# EAGLE design Scheda ufficiale 2020 team SPQR 3 (EAGLE 9.5.2)
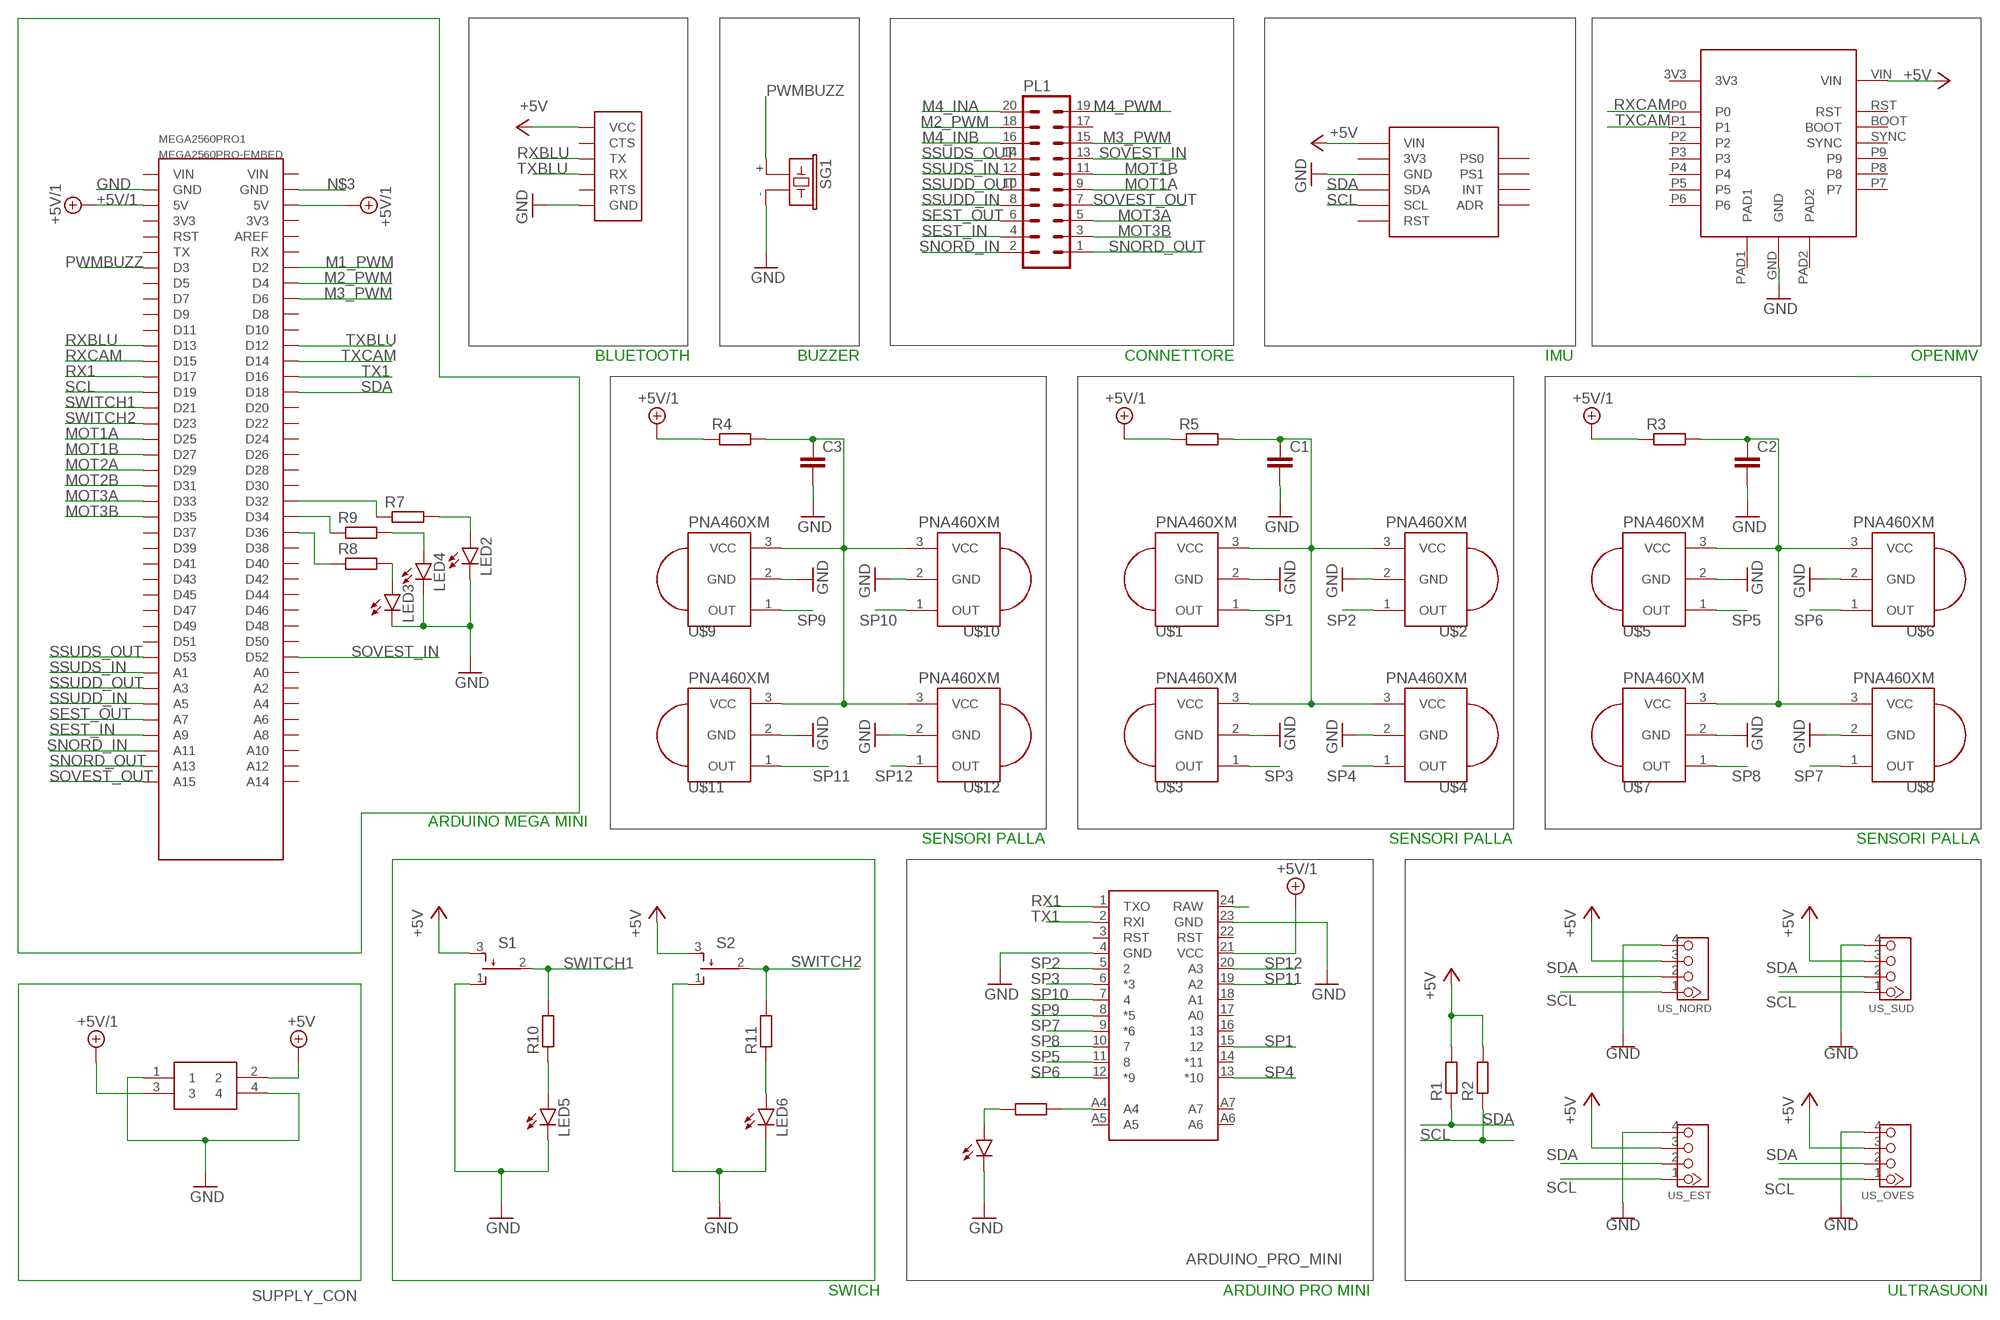
[diagram p0: schematic, sheet 1]

## Parts
ARDUINO_PRO_MINI  ARDUINO_PRO_MINI  [ARDUINO_PRO_MINI]
C1  C-EUC0805  [C0805]
C2  C-EUC0805  [C0805]
C3  C-EUC0805  [C0805]
LED1  LEDCHIPLED_1206  [CHIPLED_1206]
LED2  LEDCHIPLED_1206  [CHIPLED_1206]
LED3  LEDCHIPLED_1206  [CHIPLED_1206]
LED4  LEDCHIPLED_1206  [CHIPLED_1206]
LED5  LEDCHIPLED_1206  [CHIPLED_1206]
LED6  LEDCHIPLED_1206  [CHIPLED_1206]
MEGA2560PRO1  MEGA2560PRO-EMBED  [MEGA2560PRO-EMBED]
PL1  20V  [20V]
R1  R-EU_R0805  [R0805]
R2  R-EU_R0805  [R0805]
R3  R-EU_R0805  [R0805]
R4  R-EU_R0805  [R0805]
R5  R-EU_R0805  [R0805]
R6  R-EU_R0805  [R0805]
R7  R-EU_R0805  [R0805]
R8  R-EU_R0805  [R0805]
R9  R-EU_R0805  [R0805]
R10  R-EU_R0805  [R0805]
R11  R-EU_R0805  [R0805]
S1  TL38PO  [TL3XPO]
S2  TL38PO  [TL3XPO]
SG1  F/CM12P  [F/CM12P]
SUPPLY_CON  39-28-1043  [39-28-1043]
U$1  PNA460XM  [PNA460XM]
U$2  PNA460XM  [PNA460XM]
U$3  PNA460XM  [PNA460XM]
U$4  PNA460XM  [PNA460XM]
U$5  PNA460XM  [PNA460XM]
U$6  PNA460XM  [PNA460XM]
U$7  PNA460XM  [PNA460XM]
U$8  PNA460XM  [PNA460XM]
U$9  PNA460XM  [PNA460XM]
U$10  PNA460XM  [PNA460XM]
U$11  PNA460XM  [PNA460XM]
U$12  PNA460XM  [PNA460XM]
U$14  BLUESMIRF  [BLUESMIRF]
U$16  BNO055  [BNO055]
U$17  OPENMV_H7  [OPENMV_H7]
US_EST  TWIG_2.0  [2.0_1X4]
US_NORD  TWIG_2.0  [2.0_1X4]
US_OVES  TWIG_2.0  [2.0_1X4]
US_SUD  TWIG_2.0  [2.0_1X4]

## Nets
+5V: R1.2 R2.2 S1.3(S) S2.3(S) SUPPLY_CON.2 U$14.VCC U$16.VIN U$17.VIN US_EST.3 US_NORD.3 US_OVES.3 US_SUD.3
+5V/1: ARDUINO_PRO_MINI.21(VCC) MEGA2560PRO1.5V@1(5V) MEGA2560PRO1.5V@2(5V) R3.1 R4.1 R5.1 SUPPLY_CON.3
GND: ARDUINO_PRO_MINI.4(GND) ARDUINO_PRO_MINI.23(GND) C1.2 C2.2 C3.2 LED1.C LED2.C LED3.C LED4.C LED5.C LED6.C MEGA2560PRO1.GND@1(GND) S1.1(O) S2.1(O) SG1.- SUPPLY_CON.1 SUPPLY_CON.4 U$1.2(GND) U$2.2(GND) U$3.2(GND) U$4.2(GND) U$5.2(GND) U$6.2(GND) U$7.2(GND) U$8.2(GND) U$9.2(GND) U$10.2(GND) U$11.2(GND) U$12.2(GND) U$14.GND U$16.GND U$17.GND US_EST.4 US_NORD.4 US_OVES.4 US_SUD.4
M1_PWM: MEGA2560PRO1.D2
M2_PWM: MEGA2560PRO1.D4 PL1.18
M3_PWM: MEGA2560PRO1.D6 PL1.15
M4_INA: PL1.20
M4_INB: PL1.16
M4_PWM: PL1.19
MOT1A: MEGA2560PRO1.D25 PL1.9
MOT1B: MEGA2560PRO1.D27 PL1.11
MOT2A: MEGA2560PRO1.D29
MOT2B: MEGA2560PRO1.D31
MOT3A: MEGA2560PRO1.D33 PL1.5
MOT3B: MEGA2560PRO1.D35 PL1.3
N$1: MEGA2560PRO1.D36 R8.1
N$2: ARDUINO_PRO_MINI.24(RAW)
N$3: MEGA2560PRO1.GND@2(GND)
N$4: LED3.A R8.2
N$7: MEGA2560PRO1.D34 R9.1
N$10: ARDUINO_PRO_MINI.A4 R6.2
N$11: LED1.A R6.1
N$13: MEGA2560PRO1.D32 R7.1
N$33: LED5.A R10.1
N$35: LED4.A R9.2
N$36: LED6.A R11.1
N$39: LED2.A R7.2
POWERBLOCK1: C2.1 R3.2 U$5.3(VCC) U$6.3(VCC) U$7.3(VCC) U$8.3(VCC)
POWERBLOCK2: C1.1 R5.2 U$1.3(VCC) U$2.3(VCC) U$3.3(VCC) U$4.3(VCC)
POWERBLOCK3: C3.1 R4.2 U$9.3(VCC) U$10.3(VCC) U$11.3(VCC) U$12.3(VCC)
PWMBUZZ: MEGA2560PRO1.D3 SG1.+
RX1: ARDUINO_PRO_MINI.1(TXO) MEGA2560PRO1.D17
RXBLU: MEGA2560PRO1.D13 U$14.TX
RXCAM: MEGA2560PRO1.D15 U$17.P0
SCL: MEGA2560PRO1.D19 R2.1 U$16.SCL US_EST.1 US_NORD.1 US_OVES.1 US_SUD.1
SDA: MEGA2560PRO1.D18 R1.1 U$16.SDA US_EST.2 US_NORD.2 US_OVES.2 US_SUD.2
SEST_IN: MEGA2560PRO1.A9 PL1.4
SEST_OUT: MEGA2560PRO1.A7 PL1.6
SNORD_IN: MEGA2560PRO1.A11 PL1.2
SNORD_OUT: MEGA2560PRO1.A13 PL1.1
SOVEST_IN: MEGA2560PRO1.D52 PL1.13
SOVEST_OUT: MEGA2560PRO1.A15 PL1.7
SP1: ARDUINO_PRO_MINI.15 U$1.1(OUT)
SP2: ARDUINO_PRO_MINI.5 U$2.1(OUT)
SP3: ARDUINO_PRO_MINI.6(*3) U$3.1(OUT)
SP4: ARDUINO_PRO_MINI.13(*10) U$4.1(OUT)
SP5: ARDUINO_PRO_MINI.11 U$5.1(OUT)
SP6: ARDUINO_PRO_MINI.12(*9) U$6.1(OUT)
SP7: ARDUINO_PRO_MINI.9(*6) U$8.1(OUT)
SP8: ARDUINO_PRO_MINI.10 U$7.1(OUT)
SP9: ARDUINO_PRO_MINI.8(*5) U$9.1(OUT)
SP10: ARDUINO_PRO_MINI.7 U$10.1(OUT)
SP11: ARDUINO_PRO_MINI.19(A2) U$11.1(OUT)
SP12: ARDUINO_PRO_MINI.20(A3) U$12.1(OUT)
SSUDD_IN: MEGA2560PRO1.A5 PL1.8
SSUDD_OUT: MEGA2560PRO1.A3 PL1.10
SSUDS_IN: MEGA2560PRO1.A1 PL1.12
SSUDS_OUT: MEGA2560PRO1.D53 PL1.14
SWITCH1: MEGA2560PRO1.D21 R10.2 S1.2(P)
SWITCH2: MEGA2560PRO1.D23 R11.2 S2.2(P)
TX1: ARDUINO_PRO_MINI.2(RXI) MEGA2560PRO1.D16
TXBLU: MEGA2560PRO1.D12 U$14.RX
TXCAM: MEGA2560PRO1.D14 U$17.P1
Unconnected: ARDUINO_PRO_MINI.3(RST) ARDUINO_PRO_MINI.14(*11) ARDUINO_PRO_MINI.16 ARDUINO_PRO_MINI.17(A0) ARDUINO_PRO_MINI.18(A1) ARDUINO_PRO_MINI.22(RST) ARDUINO_PRO_MINI.A5 ARDUINO_PRO_MINI.A6 ARDUINO_PRO_MINI.A7 MEGA2560PRO1.3V3@1(3V3) MEGA2560PRO1.3V3@2(3V3) MEGA2560PRO1.A0 MEGA2560PRO1.A2 MEGA2560PRO1.A4 MEGA2560PRO1.A6 MEGA2560PRO1.A8 MEGA2560PRO1.A10 MEGA2560PRO1.A12 MEGA2560PRO1.A14 MEGA2560PRO1.AREF MEGA2560PRO1.D5 MEGA2560PRO1.D7 MEGA2560PRO1.D8 MEGA2560PRO1.D9 MEGA2560PRO1.D10 MEGA2560PRO1.D11 MEGA2560PRO1.D20 MEGA2560PRO1.D22 MEGA2560PRO1.D24 MEGA2560PRO1.D26 MEGA2560PRO1.D28 MEGA2560PRO1.D30 MEGA2560PRO1.D37 MEGA2560PRO1.D38 MEGA2560PRO1.D39 MEGA2560PRO1.D40 MEGA2560PRO1.D41 MEGA2560PRO1.D42 MEGA2560PRO1.D43 MEGA2560PRO1.D44 MEGA2560PRO1.D45 MEGA2560PRO1.D46 MEGA2560PRO1.D47 MEGA2560PRO1.D48 MEGA2560PRO1.D49 MEGA2560PRO1.D50 MEGA2560PRO1.D51 MEGA2560PRO1.RST MEGA2560PRO1.RX MEGA2560PRO1.TX MEGA2560PRO1.VIN@1(VIN) MEGA2560PRO1.VIN@2(VIN) PL1.17 U$14.CTS U$14.RTS U$16.3V3 U$16.ADR U$16.INT U$16.PS0 U$16.PS1 U$16.RST U$17.3V3 U$17.BOOT U$17.P2 U$17.P3 U$17.P4 U$17.P5 U$17.P6 U$17.P7 U$17.P8 U$17.P9 U$17.PAD1 U$17.PAD2 U$17.RST U$17.SYNC

## Notes on the sheet
- BLUETOOTH | BUZZER | CONNETTORE | IMU | OPENMV
- ARDUINO MEGA MINI
- SENSORI PALLA | SENSORI PALLA | SENSORI PALLA
- ARDUINO PRO MINI
- SWICH | ULTRASUONI

## Library data of the parts
ARDUINO_PRO_MINI = SparkFun-Boards:ARDUINO_PRO_MINI: SparkFun Pro Mini Pro Mini compatible footprint. Dimensions: 0.7 x 1.3" PCB Thickness: 0.8mm SparkFun Products: 3.3V/8MHz <https://www.sparkfun.com/products/11114> 5V/16MHz <https://www.sparkfun.com/products/11113>
C1-C3 = rcl:C-EU: CAPACITOR, European symbol; SPICEPREFIX: C
LED1-LED6 = led:LED: LED OSRAM: - CHIPLED LG R971, LG N971, LY N971, LG Q971, LY Q971, LO R971, LY R971 LH N974, LH R974 LS Q976, LO Q976, LY Q976 LO Q996 - Hyper CHIPLED LW Q18S LB Q993, LB Q99A, LB R99A - SideLED LS A670, LO A670, LY A670, LG A670, LP A670 LB A673, LV A673, LT A673, LW A673 LH A674 LY A675 LS A676, LA A676, LO A676, LY A676, LW A676 LS A679, LY A679, LG A679 - Hyper Micro SIDELED® LS Y876, LA Y876, LO Y876, LY Y876 LT Y87S - SmartLED LW L88C, LW L88S LB L89C, LB L89S, LG L890 LS L89K, LO L89K, LY L89K LS L896, LA L896, LO L896, LY L896 - TOPLED LS T670, LO T670, LY T670, LG T670, LP T670 LSG T670, LSP T670, LSY T670, LOP T670, LYG T670 LG T671, LOG T671, LSG T671 LB T673, LV T673, LT T673, LW T673 LH T674 LS T676, LA T676, LO T676, LY T676, LB T676, LH T676, LSB T676, LW T676 LB T67C, LV T67C, LT T67C, LS T67K, LO T67K, LY T67K, LW E67C LS E67B, LA E67B, LO E67B, LY E67B, LB E67C, LV E67C, LT E67C LW T67C LS T679, LY T679, LG T679 LS T770, LO T770, LY T770, LG T770, LP T770 LB T773, LV T773, LT T773, LW T773 LH T774 LS E675, LA E675, LY E675, LS T675 LS T776, LA T776, LO T776, LY T776, LB T776 LHGB T686 LT T68C, LB T68C - Hyper Mini TOPLED® LB M676 - Mini TOPLED Santana® LG M470 LS M47K, LO M47K, LY M47K Source: http://www.osram.convergy.de LUXEON: - LUMILED® LXK2-PW12-R00, LXK2-PW12-S00, LXK2-PW14-U00, LXK2-PW14-V00 LXK2-PM12-R00, LXK2-PM12-S00, LXK2-PM14-U00 LXK2-PE12-Q00, LXK2-PE12-R00, LXK2-PE12-S00, LXK2-PE14-T00, LXK2-PE14-U00 LXK2-PB12-K00, LXK2-PB12-L00, LXK2-PB12-M00, LXK2-PB14-N00, LXK2-PB14-P00, LXK2-PB14-Q00 LXK2-PR12-L00, LXK2-PR12-M00, LXK2-PR14-Q00, LXK2-PR14-R00 LXK2-PD12-Q00, LXK2-PD12-R00, LXK2-PD12-S00 LXK2-PH12-R00, LXK2-PH12-S00 LXK2-PL12-P00, LXK2-PL12-Q00, LXK2-PL12-R00 Source: www.luxeon.com KINGBRIGHT: KA-3528ASYC Source: www.kingbright.com
MEGA2560PRO1 = robotdyn:MEGA2560PRO-EMBED: Robotdyn Robotdyn Mega 2560 PRO (Embed) https://robotdyn.com/mega-2560-pro-embed-ch340g-atmega2560-16au.html
PL1 = con-harting-v:20V: CONNECTOR; OC_FARNELL: unknown; OC_NEWARK: unknown
R1-R11 = rcl:R-EU_: RESISTOR, European symbol; SPICEPREFIX: R
S1 S2 = switch:TL38PO: TINY SWITCH ON OFF MOM Source: http://www2.produktinfo.conrad.com/datenblaetter/700000-724999/705152-da-01-de-Subminiaturschalter_TL_36YO.pdf
SG1 = buzzer:F/CM12P: BUZZER Source: Buerklin; OC_FARNELL: unknown; OC_NEWARK: unknown
SUPPLY_CON = 39-28-1043:39-28-1043: Mini-Fit Jr. Vertical Header, 4.20mm Pitch, Dual Row, 4 Circuits, without Snap-in Plastic Peg PCB Lock, Tin, Natural Source: Datasheet <http://docs-emea.rs-online.com/webdocs/0460/0900766b80460da1.pdf>; DESCRIPTION: Mini-Fit Jr. Vertical Header, 4.20mm Pitch, Dual Row, 4 Circuits, without Snap-in Plastic Peg PCB Lock, Tin, Natural; HEIGHT: mm; MANUFACTURER_NAME: Molex; MANUFACTURER_PART_NUMBER: 39-28-1043; MOUSER_PART_NUMBER: 538-39-28-1043; MOUSER_PRICE-STOCK: https://www.mouser.com/Search/Refine.aspx?Keyword=538-39-28-1043; RS_PART_NUMBER: 4841899P; RS_PRICE-STOCK: http://uk.rs-online.com/web/p/products/4841899P
U$1-U$12 = Adafruit:PNA460XM: IR 38KHz receiver PNA4602 and related receivers http://www.ladyada.net/library/pcb/eaglelibrary.html
U$14 = BlueSMIRF Silver:BLUESMIRF
U$16 = BNO055:BNO055
U$17 = OpenMV4 base:OPENMV_H7
US_EST US_NORD US_OVES US_SUD = CONNECTER:TWIG_2.0

## Board
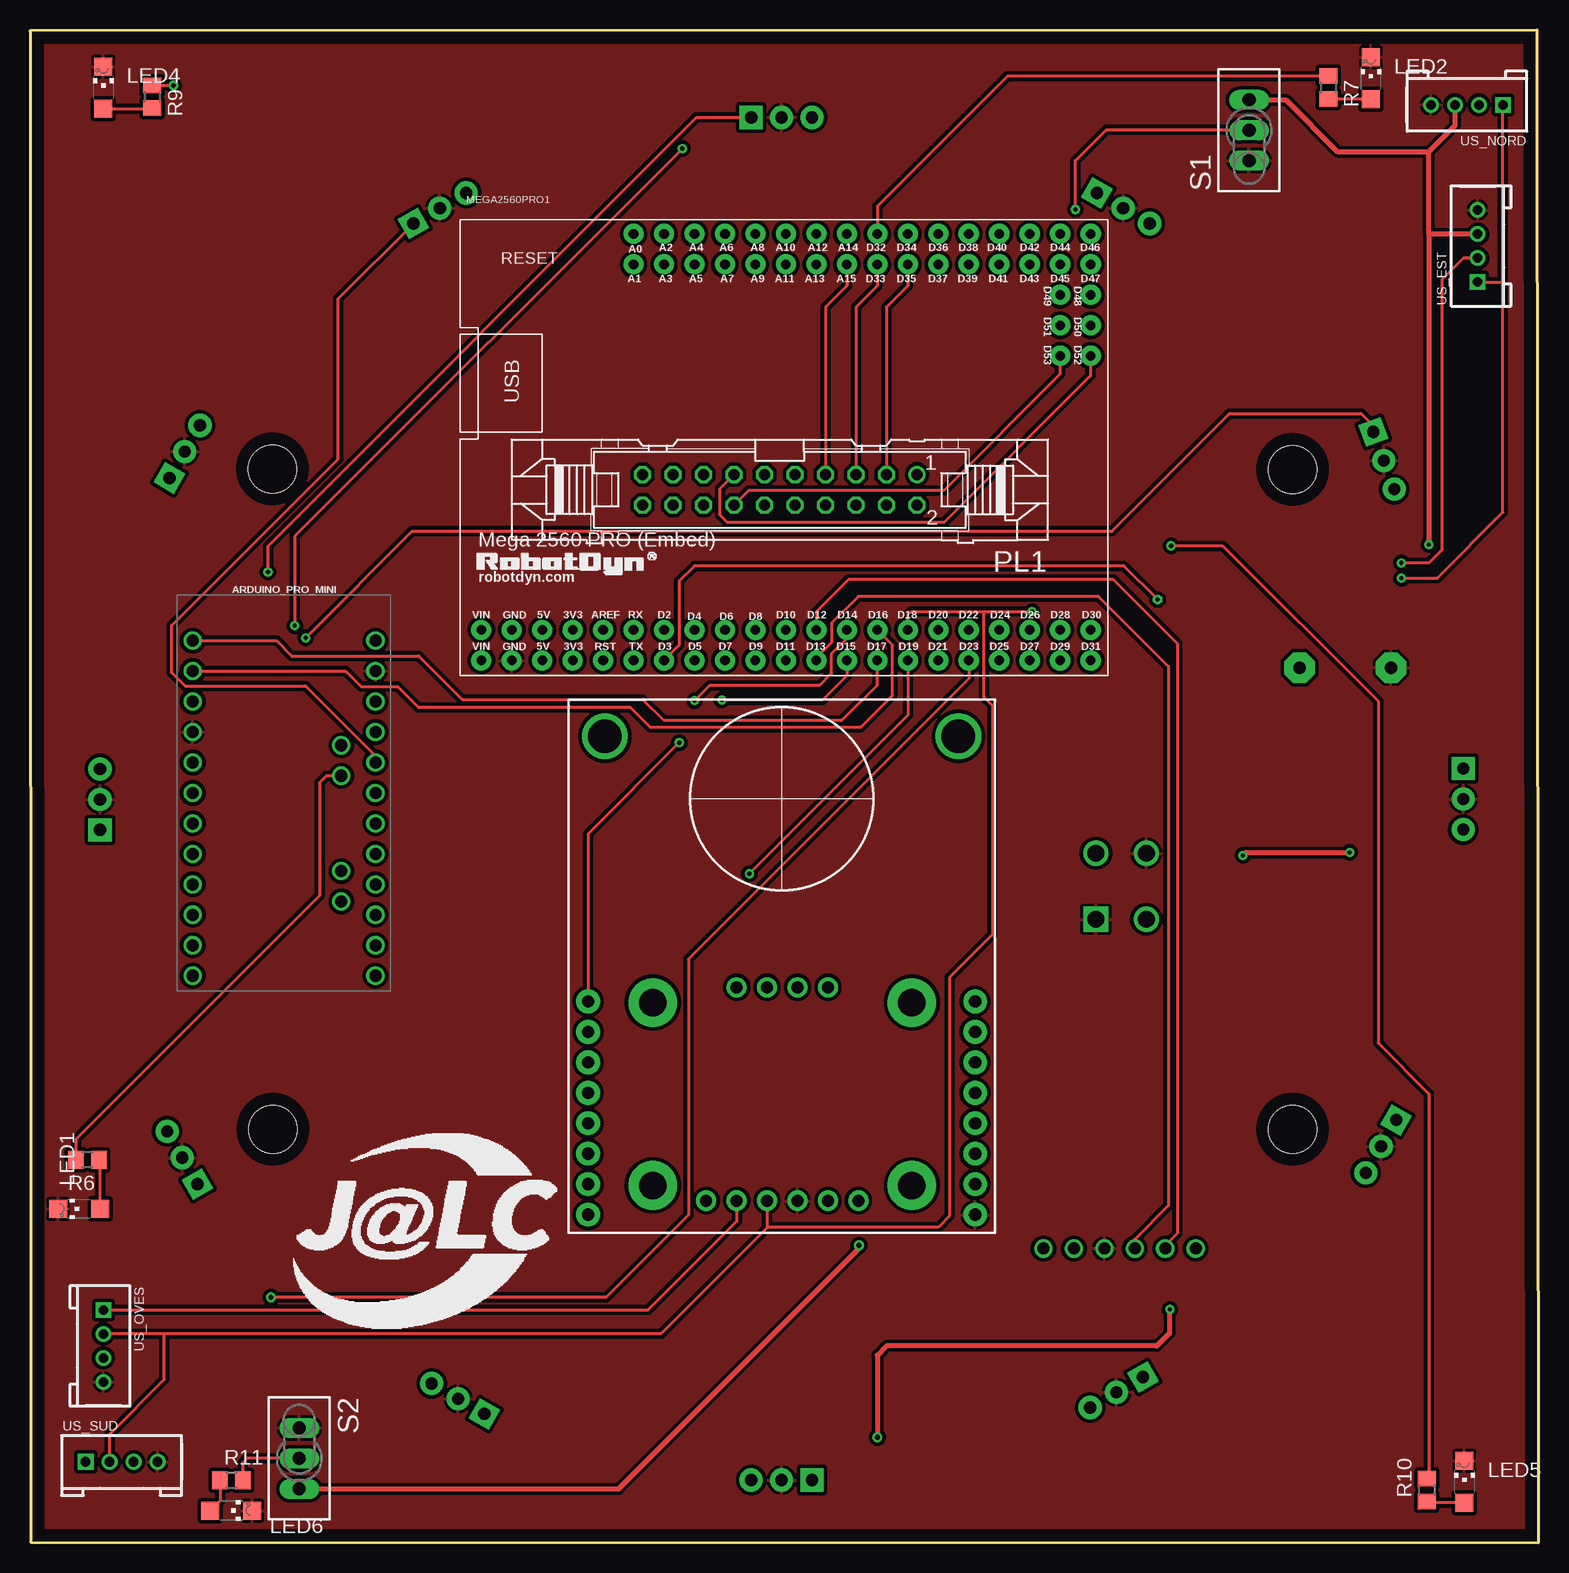
[diagram p1: board, top side]
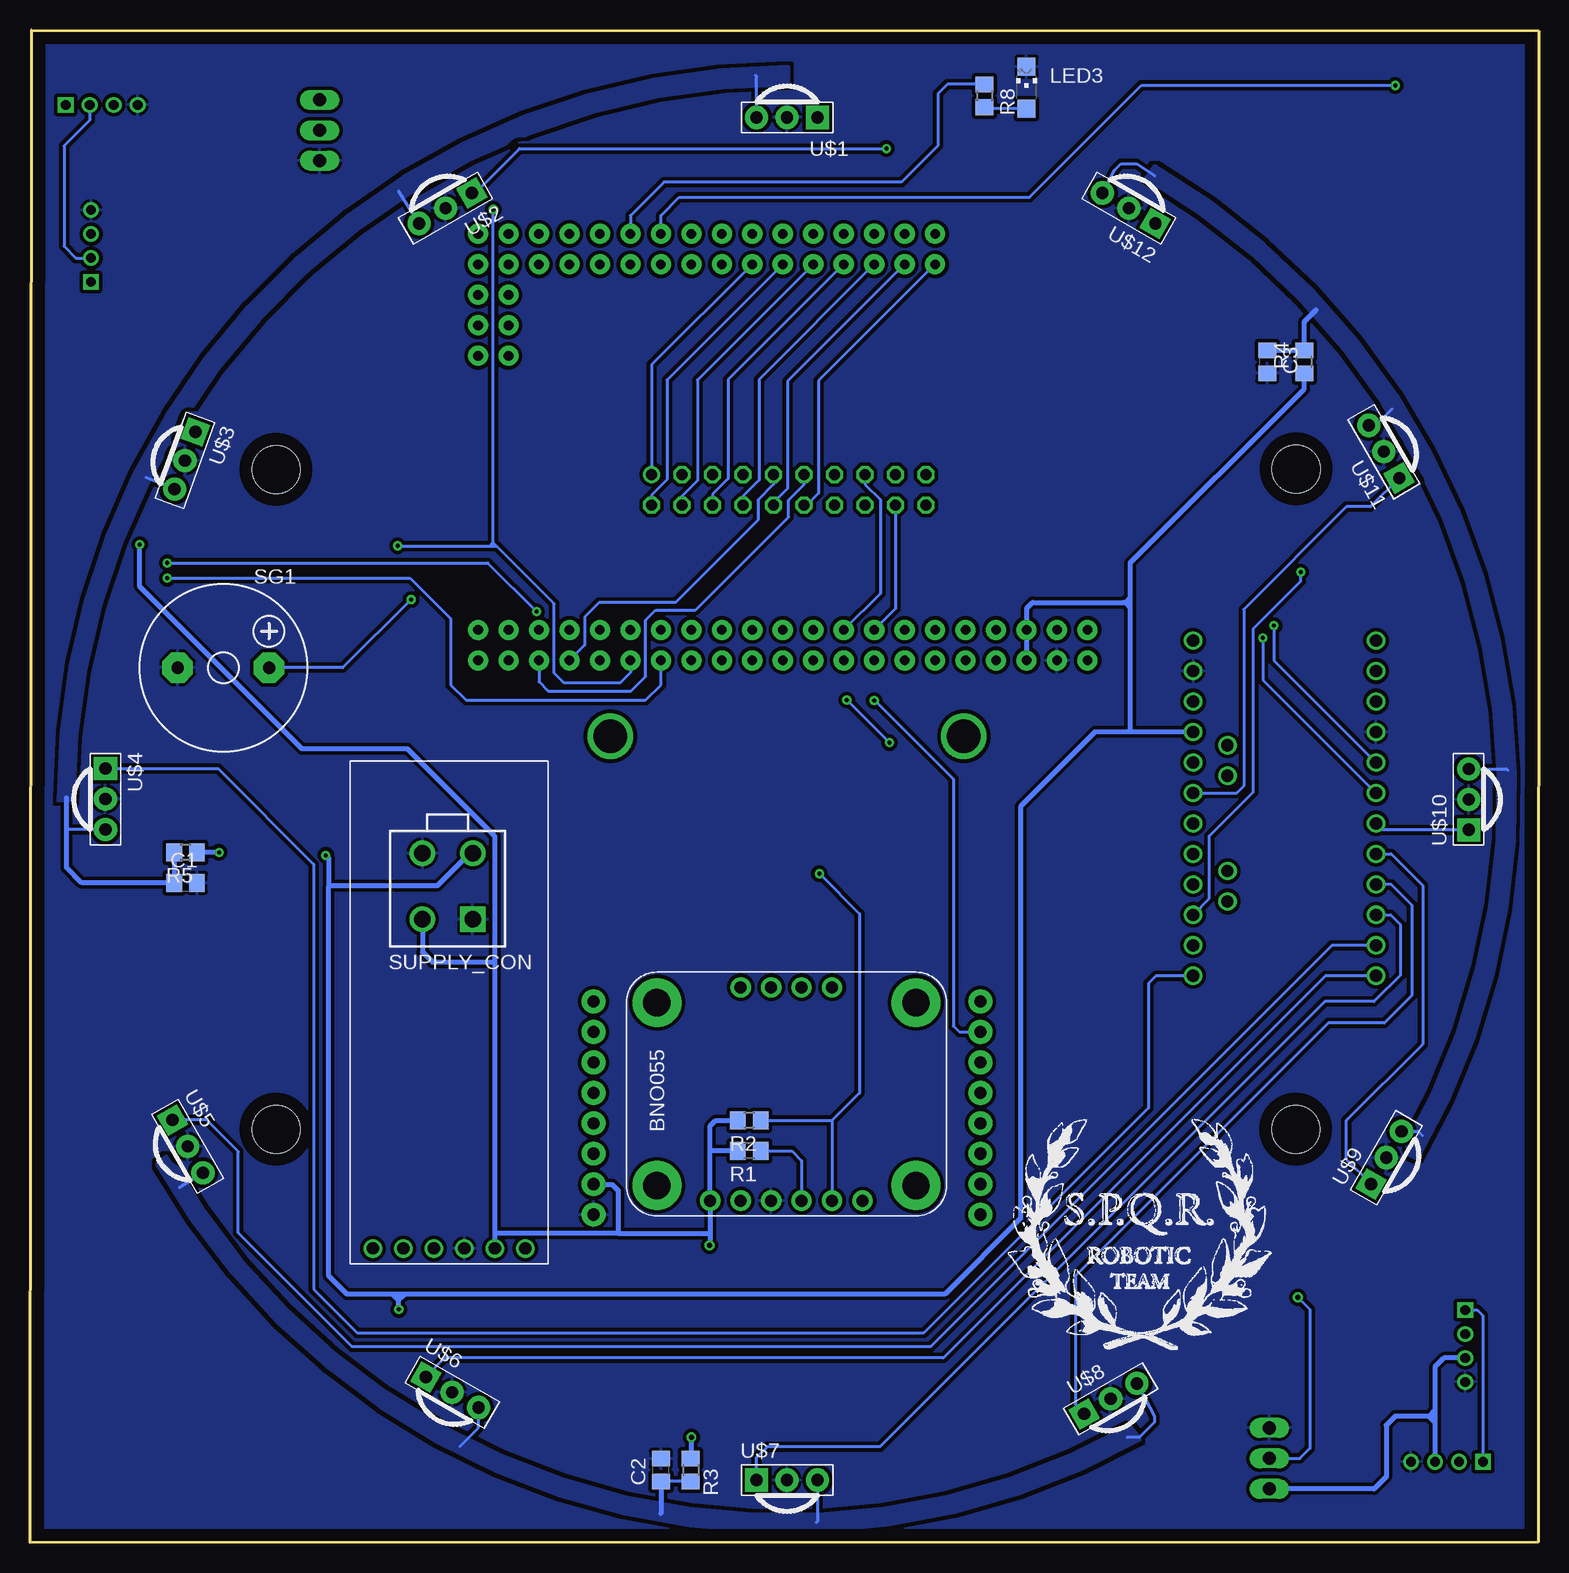
[diagram p2: board, bottom side, seen from below]

Size 125.77 x 126.1 mm. Coordinates in mm from the lower left corner, seen from the top.
Outline: 0.05,0.05 125.77,0 125.64,126.1 0,126.02 0.05,0.05
Copper layers (1*16): Top 0.035mm / dielectric 1.5mm / Bottom 0.035mm
Design rules "default *": minimum track width 6mil, minimum drill 0.35mm, track to track 12mil, track to pad 12mil, pad to pad 6mil, via to via 6mil, smd to smd 6mil, copper to edge 40mil, drill to drill 6mil, minimum pad ring 10mil, minimum via ring 8mil, stop-mask expansion 4mil, vias tented up to drill 0mil, thermal gap 10mil
Holes 4 mm at 105.26,89.46 20.22,89.5 105.26,34.46 20.26,34.46

### Footprints (pad centres in the part's own frame; a part is rotated, then mirrored left to right if it is on the bottom)
ARDUINO_PRO_MINI = drill 1.016: 1 -7.62,12.7; 2 -7.62,10.16; 3 -7.62,7.62; 4 -7.62,5.08; 5 -7.62,2.54; 6 -7.62,0; 7 -7.62,-2.54; 8 -7.62,-5.08; 9 -7.62,-7.62; 10 -7.62,-10.16; 11 -7.62,-12.7; 12 -7.62,-15.24; 13 7.62,-15.24; 14 7.62,-12.7; 15 7.62,-10.16; 16 7.62,-7.62; 17 7.62,-5.08; 18 7.62,-2.54; 19 7.62,0; 20 7.62,2.54; 21 7.62,5.08; 22 7.62,7.62; 23 7.62,10.16; 24 7.62,12.7; A4 4.763,1.429; A5 4.763,3.969; A6 4.763,-9.049; A7 4.763,-6.509
C0805 = smd 1.3 x 1.5: 1 -0.95,0; 2 0.95,0
CHIPLED_1206 = smd 1.5 x 1.5: A 0,-1.75; C 0,1.75
MEGA2560PRO-EMBED = drill 0.8 pad 1.676: 3V3@1 -25.4,-19.05; 3V3@2 -25.4,-16.51; 5V@1 -27.94,-19.05; 5V@2 -27.94,-16.51; A0 -20.32,16.51; A1 -20.32,13.97; A2 -17.78,16.51; A3 -17.78,13.97; A4 -15.24,16.51; A5 -15.24,13.97; A6 -12.7,16.51; A7 -12.7,13.97; A8 -10.16,16.51; A9 -10.16,13.97; A10 -7.62,16.51; A11 -7.62,13.97; A12 -5.08,16.51; A13 -5.08,13.97; A14 -2.54,16.51; A15 -2.54,13.97; AREF -22.86,-16.51; D2 -17.78,-16.51; D3 -17.78,-19.05; D4 -15.24,-16.51; D5 -15.24,-19.05; D6 -12.7,-16.51; D7 -12.7,-19.05; D8 -10.16,-16.51; D9 -10.16,-19.05; D10 -7.62,-16.51; D11 -7.62,-19.05; D12 -5.08,-16.51; D13 -5.08,-19.05; D14 -2.54,-16.51; D15 -2.54,-19.05; D16 0,-16.51; D17 0,-19.05; D18 2.54,-16.51; D19 2.54,-19.05; D20 5.08,-16.51; D21 5.08,-19.05; D22 7.62,-16.51; D23 7.62,-19.05; D24 10.16,-16.51; D25 10.16,-19.05; D26 12.7,-16.51; D27 12.7,-19.05; D28 15.24,-16.51; D29 15.24,-19.05; D30 17.78,-16.51; D31 17.78,-19.05; D32 0,16.51; D33 0,13.97; D34 2.54,16.51; D35 2.54,13.97; D36 5.08,16.51; D37 5.08,13.97; D38 7.62,16.51; D39 7.62,13.97; D40 10.16,16.51; D41 10.16,13.97; D42 12.7,16.51; D43 12.7,13.97; D44 15.24,16.51; D45 15.24,13.97; D46 17.78,16.51; D47 17.78,13.97; D48 17.78,11.43; D49 15.24,11.43; D50 17.78,8.89; D51 15.24,8.89; D52 17.78,6.35; D53 15.24,6.35; GND@1 -30.48,-19.05; GND@2 -30.48,-16.51; RST -22.86,-19.05; RX -20.32,-16.51; TX -20.32,-19.05; VIN@1 -33.02,-19.05; VIN@2 -33.02,-16.51
20V = drill 0.914: 1 -11.43,-1.27 | drill 0.914 octagon: 2 -11.43,1.27; 3 -8.89,-1.27; 4 -8.89,1.27; 5 -6.35,-1.27; 6 -6.35,1.27; 7 -3.81,-1.27; 8 -3.81,1.27; 9 -1.27,-1.27; 10 -1.27,1.27; 11 1.27,-1.27; 12 1.27,1.27; 13 3.81,-1.27; 14 3.81,1.27; 15 6.35,-1.27; 16 6.35,1.27; 17 8.89,-1.27; 18 8.89,1.27; 19 11.43,-1.27; 20 11.43,1.27
R0805 = smd 1.3 x 1.5: 1 -0.95,0; 2 0.95,0
TL3XPO = drill 1.1 pad 1.422 long: 1 -2.54,0; 2 0,0; 3 2.54,0
F/CM12P = drill 1.016 pad 2.54 octagon: + 3.81,0; - -3.81,0
39-28-1043 = drill 1.4 pad 2.1 square: 1 -2.1,7.35 | drill 1.4 pad 2.1: 2 2.1,7.35; 3 -2.1,1.85; 4 2.1,1.85
PNA460XM = drill 1.016 pad 1.93 square: 1 -2.54,0 | drill 1.016 pad 1.93: 2 0,0; 3 2.54,0
BLUESMIRF = drill 1.016: CTS 40.64,14.605; GND 40.64,9.525; RTS 40.64,1.905; RX 40.64,4.445; TX 40.64,6.985; VCC 40.64,12.065
BNO055 = drill 1 pad 1.676: 3V3 9.525,1.27; ADR 17.145,19.05; GND 12.065,1.27; INT 14.605,19.05; PS0 9.525,19.05; PS1 12.065,19.05; RST 19.685,1.27; SCL 17.145,1.27; SDA 14.605,1.27; VIN 6.985,1.27 | drill 2.286 pad 4.064: PAD@1 2.54,17.78; PAD@2 24.13,17.78; PAD@3 2.54,2.54; PAD@4 24.13,2.54
OPENMV_H7 = drill 1.016 pad 1.981: 3V3 1.651,1.524; BOOT 33.909,16.764; GND 33.909,1.524; P0 1.651,19.304; P1 1.651,16.764; P2 1.651,14.224; P3 1.651,11.684; P4 1.651,9.144; P5 1.651,6.604; P6 1.651,4.064; P7 33.909,6.604; P8 33.909,9.144; P9 33.909,11.684; RST 33.909,19.304; SYNC 33.909,14.224; VIN 33.909,4.064 | drill 2.794 pad 3.81: PAD1 3.048,41.402 | drill 2.794: PAD2 32.512,41.402
2.0_1X4 = drill 0.8 pad 1.27 square: 1 -3,0 | drill 0.8 pad 1.27: 2 -1,0; 3 1,0; 4 3,0

### Placement (x,y rotation side)
ARDUINO_PRO_MINI  21.18,62.5 0 top
C1  112.8,55 0 bottom
C2  73.17,6.06 90 bottom
C3  22.63,98.44 270 bottom
LED1  4.09,27.82 90 top
LED2  111.78,122.06 0 top
LED3  42.69,121.3 0 bottom
LED4  6.12,121.3 0 top
LED5  119.58,5.07 0 top
LED6  16.79,2.68 270 top
MEGA2560PRO1  70.63,92.59 0 top
PL1  62.51,87.77 180 top
R1  65.81,32.65 180 bottom
R2  65.81,35.19 180 bottom
R3  70.68,6.06 270 bottom
R4  19.55,98.44 90 bottom
R5  112.8,57.54 180 bottom
R6  4.8,31.91 180 top
R7  108.23,121.3 270 top
R8  46.2,120.61 270 bottom
R9  10.18,120.53 270 top
R10  116.46,4.38 90 top
R11  16.79,5.22 0 top
S1  101.62,117.74 90 top
S2  22.45,7.02 270 top
SG1  109.65,72.93 0 bottom
SUPPLY_CON  90.95,59.32 180 bottom
U$1  62.66,118.81 180 bottom
U$2  91.13,111.24 210 bottom
U$3  112.85,90.21 250 bottom
U$4  119.48,61.99 270 bottom
U$5  112.62,33.03 300 bottom
U$6  90.57,12.53 330 bottom
U$7  62.66,5.22 0 bottom
U$8  35.68,12 30 bottom
U$9  12.7,32.09 60 bottom
U$10  5.84,61.96 90 bottom
U$11  12.9,90.94 120 bottom
U$12  34.16,111.24 150 bottom
U$14  99.08,65.16 270 bottom
U$16  76.04,27.24 0 bottom
U$17  44.88,25.82 0 top
US_EST  120.67,108.09 90 top
US_NORD  119.78,119.85 180 top
US_OVES  6.12,16.39 270 top
US_SUD  7.64,6.74 0 top

### Tracks (layer width: path | path; a pad name or v marks a point on that pad's centre or on a via)
+5V  (via drill 0.35, 0.41)
  Top 0.406: US_NORD.3 118.78,118.14 116.61,115.96 | S2.3 49.07,4.48 69.11,24.52 v69.11,24.78 | S1.3 104.67,120.28 108.99,115.96 116.61,115.96 | 116.61,109.1 v116.61,83.2 | 116.61,109.1 116.61,115.96 | 116.61,109.1 116.62,109.09 US_EST.3
  Bottom 0.406: US_OVES.3 7.9,15.39 8.64,14.65 8.64,11.06 | 8.64,11.06 8.64,10.55 | 8.64,10.55 8.64,10.04 | 8.64,10.04 US_SUD.3 | 8.64,10.55 9.15,10.55 | 9.15,10.55 11.96,10.55 12.72,9.79 12.72,5.47 13.71,4.48 S2.3 | 8.64,11.06 9.15,10.55 | 9.15,10.55 8.64,10.04 | 69.06,32.65 U$16.VIN 69.06,25.79 | 69.06,32.65 69.06,34.73 68.6,35.19 R2.2 | R1.2 69.06,32.65 | 87.02,48.4 87.02,58.89 94.3,66.18 103.09,66.18 116.61,79.69 v116.61,83.2 | 87.02,48.4 87.02,25.79 | 87.02,25.79 U$14.VCC | 76.73,25.79 87.02,25.79 | U$17.VIN 78.76,29.86 77.24,29.86 76.73,29.35 76.73,25.79 | 76.73,25.79 69.06,25.79 | 69.06,25.79 69.06,24.83 v69.11,24.78 | SUPPLY_CON.2 93.05,49.23 92.22,48.4 87.02,48.4
+5V/1  (via drill 0.35, 0.41)
  Top 0.406: v70.63,8.77 70.63,15.63 71.4,16.39 93.93,16.39 95.02,17.48 v95.02,19.44 | v101.11,57.29 101.37,57.54 v110,57.54
  Bottom 0.254: 34.06,78.9 34.59,78.37 | 34.62,78.37 34.59,78.37 | 34.59,78.37 34.06,77.84
  Bottom 0.406: MEGA2560PRO1.5V@1 MEGA2560PRO1.5V@2 42.69,77.86 42.19,78.37 34.62,78.37 34.06,78.37 | 100.86,54.75 100.86,22.24 99.34,20.71 95.53,20.71 | v70.63,8.77 R3.1 | R4.1 19.55,96.18 34.06,81.67 34.06,78.9 34.06,78.37 | 94.51,20.71 49.51,20.71 43.2,27.03 43.2,61.35 36.98,67.58 34.06,67.58 | 94.51,20.71 95.02,20.71 | 95.02,20.71 95.53,20.71 | SUPPLY_CON.3 89.11,57.47 91.83,54.75 100.86,54.75 | v101.11,57.29 100.86,57.03 100.86,54.75 | v110,57.54 R5.1 | v95.02,19.44 95.02,20.2 | 95.02,20.2 95.02,20.71 | 94.51,20.71 95.02,20.2 | 95.53,20.71 95.02,20.2 | ARDUINO_PRO_MINI.21 34.06,67.58 | 34.06,78.37 34.06,77.84 34.06,67.58
GND
  pour Top (rank 2): -2.52,129.42 129.56,129.42 129.56,-2.66 -2.52,-2.66
  pour Bottom (rank 2): -5.06,131.96 132.1,131.96 132.1,111.64 132.1,-5.2 96.54,-5.2 -5.06,-5.2 -5.06,76.08
M2_PWM
  Bottom 0.254: PL1.18 53.62,77.86 MEGA2560PRO1.D4
M3_PWM
  Bottom 0.254: PL1.15 56.16,88.2 54.89,86.93 54.89,79.13 MEGA2560PRO1.D6
MOT1A
  Bottom 0.254: MEGA2560PRO1.D25 79.52,74.81 79.52,77.16 78.31,78.37 71.95,78.37 65.1,85.22 65.1,86.9 63.78,88.23 PL1.9
MOT1B
  Bottom 0.254: MEGA2560PRO1.D27 83.33,71.77 82.57,71 75.66,71 74.44,72.22 74.44,76.9 73.61,77.74 73.48,77.74 70.3,77.74 62.53,85.5 62.53,86.9 61.24,88.2 PL1.11
MOT3A
  Top 0.254: MEGA2560PRO1.D33 70.63,104.79 68.86,103.01 PL1.5
MOT3B
  Top 0.254: MEGA2560PRO1.D35 73.17,104.79 71.4,103.01 PL1.3
N$1
  Bottom 0.254: R8.1 49.29,121.56 50.06,120.79 50.06,116.47 53.11,113.42 72.92,113.42 75.71,110.63 MEGA2560PRO1.D36
N$4
  Bottom 0.254: LED3.A 46.08,119.55 R8.2
N$7  (via drill 0.35)
  Top 0.254: R9.1 11.95,121.48 v11.96,121.47
  Bottom 0.254: MEGA2560PRO1.D34 73.17,110.63 71.65,112.15 42.44,112.15 33.12,121.47 v11.96,121.47
N$10
  Top 0.254: R6.2 3.85,33.66 24.15,53.96 24.15,63.38 24.69,63.92 ARDUINO_PRO_MINI.A4
N$11
  Top 0.254: LED1.A 5.84,31.83 R6.1
N$13
  Top 0.254: R7.1 81.49,122.25 70.63,111.39 MEGA2560PRO1.D32
N$33
  Top 0.254: LED5.A 116.57,3.32 R10.1
N$35
  Top 0.254: R9.2 10.14,119.55 LED4.A
N$36
  Top 0.254: R11.1 15.84,3.48 LED6.A
N$39
  Top 0.254: LED2.A 108.26,120.31 R7.2
POWERBLOCK1
  Bottom 0.254: U$7.3 60.12,1.76 60.22,1.66 | 89.94,8.01 88.37,9.58 U$6.3 | U$8.3 32.03,10.55 32.03,10.04 33.3,8.77 34.31,8.77 | U$5.3 113.31,29.6 | R3.2 C2.1
  Bottom 0.406: C2.1 73.17,2.42
  pour Bottom (isolate 0.813): 34.06,9.79 arc90 114.22,32.45 115.24,31.58 arc-90 33.17,8.62
POWERBLOCK2
  Bottom 0.254: U$1.3 65.2,122.21 65.3,122.31 | U$4.3 122.58,59.45 122.7,59.32 | U$2.3 95.02,112.66 | U$3.3 116.1,88.78
  Bottom 0.406: R5.2 C1.1 121.43,55 122.7,56.27 122.7,59.32 122.7,62.11
  pour Bottom (isolate 0.813): 62.51,121.55 62.51,123.07 arc-90 123.47,61.86 122.07,61.86 arc90
POWERBLOCK3
  Bottom 0.254: U$10.3 2.66,64.5 2.56,64.4 | U$12.3 35.33,114.44 34.82,114.95 33.55,114.95 32.03,113.93 | U$9.3 10.04,34.29 9.67,33.92 | U$11.3 13.6,93.14 12.21,94.52
  Bottom 0.406: C3.1 R4.2 19.55,101.76 18.56,102.75
  pour Bottom (isolate 0.813): 32.79,113.73 32.05,114.82 arc90 10.13,31.94 11.43,32.55 arc-90
PWMBUZZ  (via drill 0.35)
  Top 0.254: MEGA2560PRO1.D3 54.12,74.81 54.12,80.15 55.39,81.42 91.21,81.42 v94,78.62
  Bottom 0.254: v94,78.62 99.69,72.93 SG1.+
RX1
  Top 0.254: MEGA2560PRO1.D17 70.63,71.51 67.64,68.52 52.86,68.52 51.08,70.3 36.04,70.3 32.41,73.93 21.81,73.93 20.54,75.2 ARDUINO_PRO_MINI.1
RXBLU
  Top 0.254: MEGA2560PRO1.D13 65.55,73.77 66.82,75.04 66.82,76.65 69.05,78.88 89.08,78.88 94.92,73.04 94.92,28.1 92.1,25.28 U$14.TX
RXCAM  (via drill 0.35)
  Top 0.254: MEGA2560PRO1.D15 68.09,72.27 66.06,70.24 v57.68,70.24 | v54.12,66.69 46.53,59.09 U$17.P0
  Bottom 0.254: v57.68,70.24 v54.12,66.69
SCL  (via drill 0.35)
  Top 0.254: v114.32,80.4 117.29,80.4 122.78,85.89 122.78,105.04 | US_OVES.1 51.54,19.39 58.95,26.81 58.95,28.46 U$16.SCL | v59.97,55.76 73.17,68.97 MEGA2560PRO1.D19 | 122.78,105.04 US_NORD.1 | US_EST.1 122.73,105.09 122.78,105.04
  Bottom 0.254: v114.32,80.4 94.09,80.4 90.7,77.01 90.7,71.51 89.43,70.24 74.44,70.24 73.17,71.51 MEGA2560PRO1.D19 | US_OVES.1 5.1,19.39 4.64,18.93 US_SUD.1 | 58.9,35.11 58.9,35.19 56.61,37.48 56.61,52.41 v59.97,55.76 | 58.9,35.11 U$16.SCL | R2.1 58.97,35.19 58.9,35.11
SDA  (via drill 0.35)
  Top 0.254: v114.32,81.67 116.61,81.67 117.71,82.78 117.71,105.32 119.48,107.09 US_EST.2 | US_OVES.2 6.13,17.41 11.2,17.41 | 11.2,17.41 52.6,17.41 61.49,26.3 | US_SUD.2 6.64,9.04 11.2,13.6 11.2,17.41 | 79.52,77.61 79.52,70.5 80.23,69.79 80.23,50.68 76.66,47.11 76.66,27.25 75.71,26.3 61.49,26.3 | MEGA2560PRO1.D18 73.17,77.35 73.43,77.61 79.52,77.61 | U$16.SDA 61.44,26.35 61.49,26.3 | 79.52,77.61 v83.54,77.61
  Bottom 0.254: US_NORD.2 120.78,118.58 122.93,116.44 122.93,108.07 121.94,107.09 US_EST.2 | R1.1 62.25,32.65 61.44,31.84 U$16.SDA | v114.32,81.67 87.6,81.67 v83.54,77.61
SEST_IN
  Bottom 0.254: MEGA2560PRO1.A9 70.13,96.91 70.13,88.52 71.4,87.25 PL1.4
SEST_OUT
  Bottom 0.254: MEGA2560PRO1.A7 67.56,96.94 67.56,88.7 68.86,87.4 PL1.6
SNORD_IN
  Bottom 0.254: MEGA2560PRO1.A11 72.67,96.91 72.67,88.6 73.94,87.33 PL1.2
SNORD_OUT
  Bottom 0.254: MEGA2560PRO1.A13 73.94,98.18 PL1.1
SOVEST_IN
  Top 0.254: MEGA2560PRO1.D52 88.41,97.27 76.2,85.05 58.14,85.05 57.53,85.66 57.53,87.87 PL1.13
SOVEST_OUT
  Top 0.254: MEGA2560PRO1.A15 68.09,104.79 66.32,103.01 PL1.7
SP1  (via drill 0.35)
  Top 0.254: v19.83,80.91 19.83,83.07 55.57,118.81 U$1.1
  Bottom 0.254: ARDUINO_PRO_MINI.15 27.45,53.68 27.45,58.91 23.79,62.57 23.79,76.19 19.83,80.15 v19.83,80.91
SP2  (via drill 0.35)
  Top 0.254: v54.38,116.22 22.07,83.91 v22.07,76.44
  Bottom 0.254: v22.07,76.44 22.07,73.54 ARDUINO_PRO_MINI.5 | U$2.1 88.68,112.51 84.97,116.22 v54.38,116.22
SP3  (via drill 0.35)
  Top 0.254: v22.98,75.42 31.87,84.31 90.19,84.31 100,94.12 110.96,94.12 111.98,93.1 U$3.1
  Bottom 0.254: v22.98,75.42 22.98,71.92 ARDUINO_PRO_MINI.6
SP4
  Bottom 0.254: U$4.1 110.09,64.53 102.11,56.55 102.11,21.13 98.5,17.51 51.25,17.51 32.53,36.23 32.53,46.62 31.9,47.26 ARDUINO_PRO_MINI.13
SP5
  Bottom 0.254: ARDUINO_PRO_MINI.11 17.24,49.8 50.69,16.34 98.92,16.34 108.4,25.83 108.4,32.61 111.03,35.23 U$5.1 | U$5.1
SP6
  Bottom 0.254: U$6.1 91.18,15.39 49.64,15.39 17.78,47.26 ARDUINO_PRO_MINI.12
SP7
  Bottom 0.254: ARDUINO_PRO_MINI.9 12.29,54.88 10.59,53.17 10.59,45.6 12.87,43.32 17.55,43.32 38.63,22.24 38.63,11.55 37.88,10.81 U$8.1
SP8
  Bottom 0.254: ARDUINO_PRO_MINI.10 12.34,52.34 11.5,51.5 11.5,47.33 13.74,45.1 17.83,45.1 54.91,8.01 64.28,8.01 65.2,7.1 U$7.1
SP9
  Bottom 0.254: ARDUINO_PRO_MINI.8 12.29,57.42 9.67,54.8 9.67,41.54 16.02,35.19 16.02,31.95 U$9.1
SP10
  Bottom 0.254: U$10.1 13.03,59.42 ARDUINO_PRO_MINI.7
SP11
  Bottom 0.254: ARDUINO_PRO_MINI.19 25.17,62.5 24.59,63.07 24.59,77.79 16.03,86.36 14.02,86.36 U$11.1 | U$11.1
SP12
  Top 0.254: U$12.1 25.68,103.68 25.68,90.33 11.81,76.47 11.81,72.53 12.93,71.41 22.98,71.41 28.8,65.59 ARDUINO_PRO_MINI.20
SSUDD_IN
  Bottom 0.254: MEGA2560PRO1.A5 64.99,96.96 64.99,88.56 66.32,87.24 PL1.8
SSUDD_OUT
  Bottom 0.254: MEGA2560PRO1.A3 62.61,96.81 62.61,87.87 63.78,86.7 PL1.10
SSUDS_IN
  Bottom 0.254: MEGA2560PRO1.A1 60.02,96.86 60.02,87.49 61.01,86.5 PL1.12
SSUDS_OUT
  Top 0.254: MEGA2560PRO1.D53 85.87,97.42 76.17,87.72 59.91,87.72 PL1.14
SWITCH1  (via drill 0.35)
  Top 0.254: v87.14,111.14 87.14,115.2 89.71,117.77 101.6,117.77 S1.2 | v95.12,83.09 99.44,83.09 112.39,70.14 112.39,41.64 116.61,37.42 116.61,5.48 R10.2
  Bottom 0.254: 87.14,83.09 87.14,83.35 | 87.14,83.35 v87.14,111.14 | v95.12,83.09 87.4,83.09 | 87.4,83.09 87.14,83.09 | 87.14,83.09 86.89,83.09 | 87.14,83.35 86.89,83.09 | 87.14,83.35 87.4,83.09 | MEGA2560PRO1.D21 75.71,72.53 76.58,71.66 81.26,71.66 82.06,72.47 82.06,78.27 86.89,83.09
SWITCH2  (via drill 0.41)
  Top 0.254: S2.2 18.08,7.02 17.74,6.68 R11.2 | MEGA2560PRO1.D23 78.25,72.02 54.89,48.65 54.89,27.32 48.03,20.46 v20.09,20.46
  Bottom 0.254: v20.09,20.46 19.07,19.44 19.07,7.86 19.91,7.02 S2.2
TX1
  Top 0.254: MEGA2560PRO1.D16 71.9,74.81 71.9,70.62 70.89,69.61 69.24,67.96 51.71,67.96 50.06,69.61 32.41,69.61 30.65,71.36 27.61,71.36 26.31,72.66 ARDUINO_PRO_MINI.2
TXBLU
  Top 0.254: U$14.RX 94.64,24.78 95.65,25.79 95.65,74.94 90.29,80.3 68.24,80.3 65.55,77.61 MEGA2560PRO1.D12
TXCAM  (via drill 0.35)
  Top 0.254: MEGA2560PRO1.D14 68.04,76.03 68.04,75.32 66.82,74.1 66.82,72.47 65.81,71.46 56.66,71.46 v55.39,70.19
  Bottom 0.254: v55.39,70.19 55.34,70.19 48.79,63.64 48.79,43.06 48.28,42.56 46.55,42.56 U$17.P1